# EAGLE design cooler (EAGLE 8.0.0)
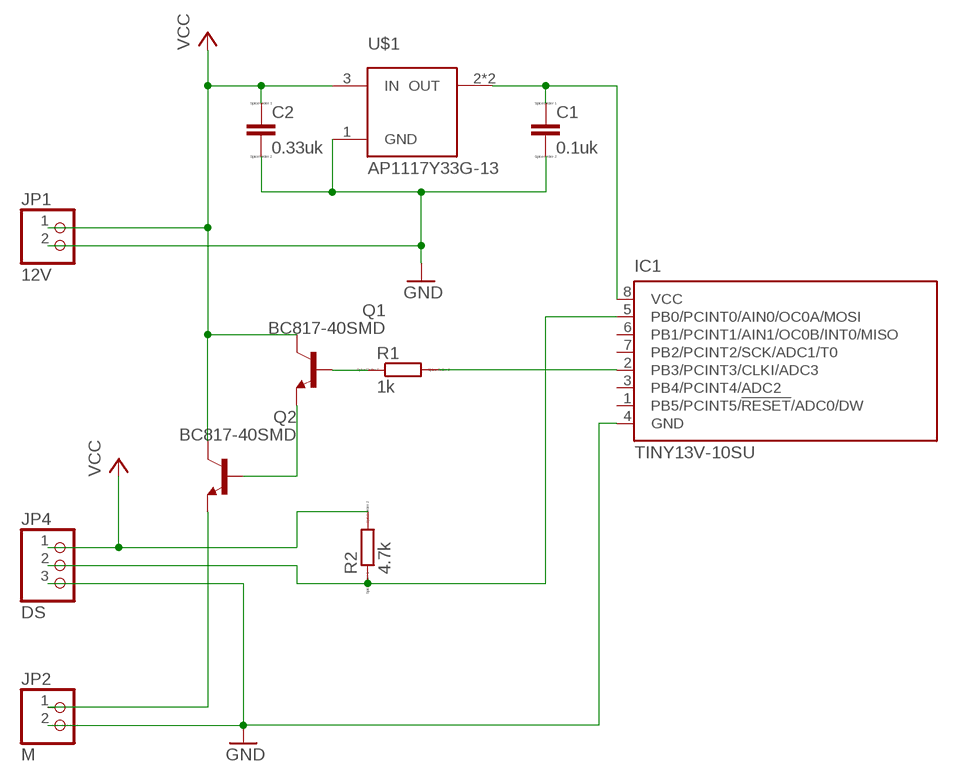
[diagram p0: schematic, sheet 1]

## Parts
C1  0.1uk  C  [C0805]
C2  0.33uk  C  [C0805]
IC1  TINY13V-10SU  [8S2]
JP1  12V  PINHD-1X2/90  [1X02/90]
JP2  M  PINHD-1X2/90  [1X02/90]
JP4  DS  PINHD-1X3/90  [1X03/90]
Q1  BC817-40SMD  [SOT23-BEC]
Q2  BC817-40SMD  [SOT23-BEC]
R1  1k  R  [R0805]
R2  4.7k  R  [R0805]
U$1  AP1117Y33G-13  [SOT89]

## Nets
GND: C1.2 C2.2 IC1.4(GND) JP1.2 JP2.2 JP4.3 U$1.1(GND)
N$1: C1.1 IC1.8(VCC) U$1.2(OUT) U$1.2@1(OUT)
N$2: JP2.1 Q2.E
N$3: Q1.E Q2.B
N$4: Q1.B R1.1
N$5: IC1.2(PB3/PCINT3/CLKI/ADC3) R1.2
N$7: IC1.5(PB0/PCINT0/AIN0/OC0A/MOSI) JP4.2 R2.1
VCC: C2.1 JP1.1 JP4.1 Q1.C Q2.C R2.2 U$1.3(IN)
Unconnected: IC1.1(PB5/PCINT5/!RESET!/ADC0/DW) IC1.3(PB4/PCINT4/ADC2) IC1.6(PB1/PCINT1/AIN1/OC0B/INT0/MISO) IC1.7(PB2/PCINT2/SCK/ADC1/T0)

## Library data of the parts
C1 C2 = eagle-ltspice:C: CAPACITOR, European symbol; SPICEMODEL: NONE; SPICEPREFIX: C
IC1 = atmel:TINY13: 8-bit AVR Microcontroller with 1K Bytes In-System Programmable Flash Source: http://www.atmel.com/dyn/resources/prod_documents/2535S.pdf; MPN: ATTINY13V-10SU; OC_FARNELL: 9171584; OC_NEWARK: 96K6524
JP1 JP2 = pinhead:PINHD-1X2: PIN HEADER
JP4 = pinhead:PINHD-1X3: PIN HEADER
Q1 Q2 = transistor-npn:BC817*: NPN Transistor
R1 R2 = eagle-ltspice:R: RESISTOR, European symbol; SPICEMODEL: NONE; SPICEPREFIX: R
U$1 = AP1117Y33G-13:AP1117Y33G-13

## Board
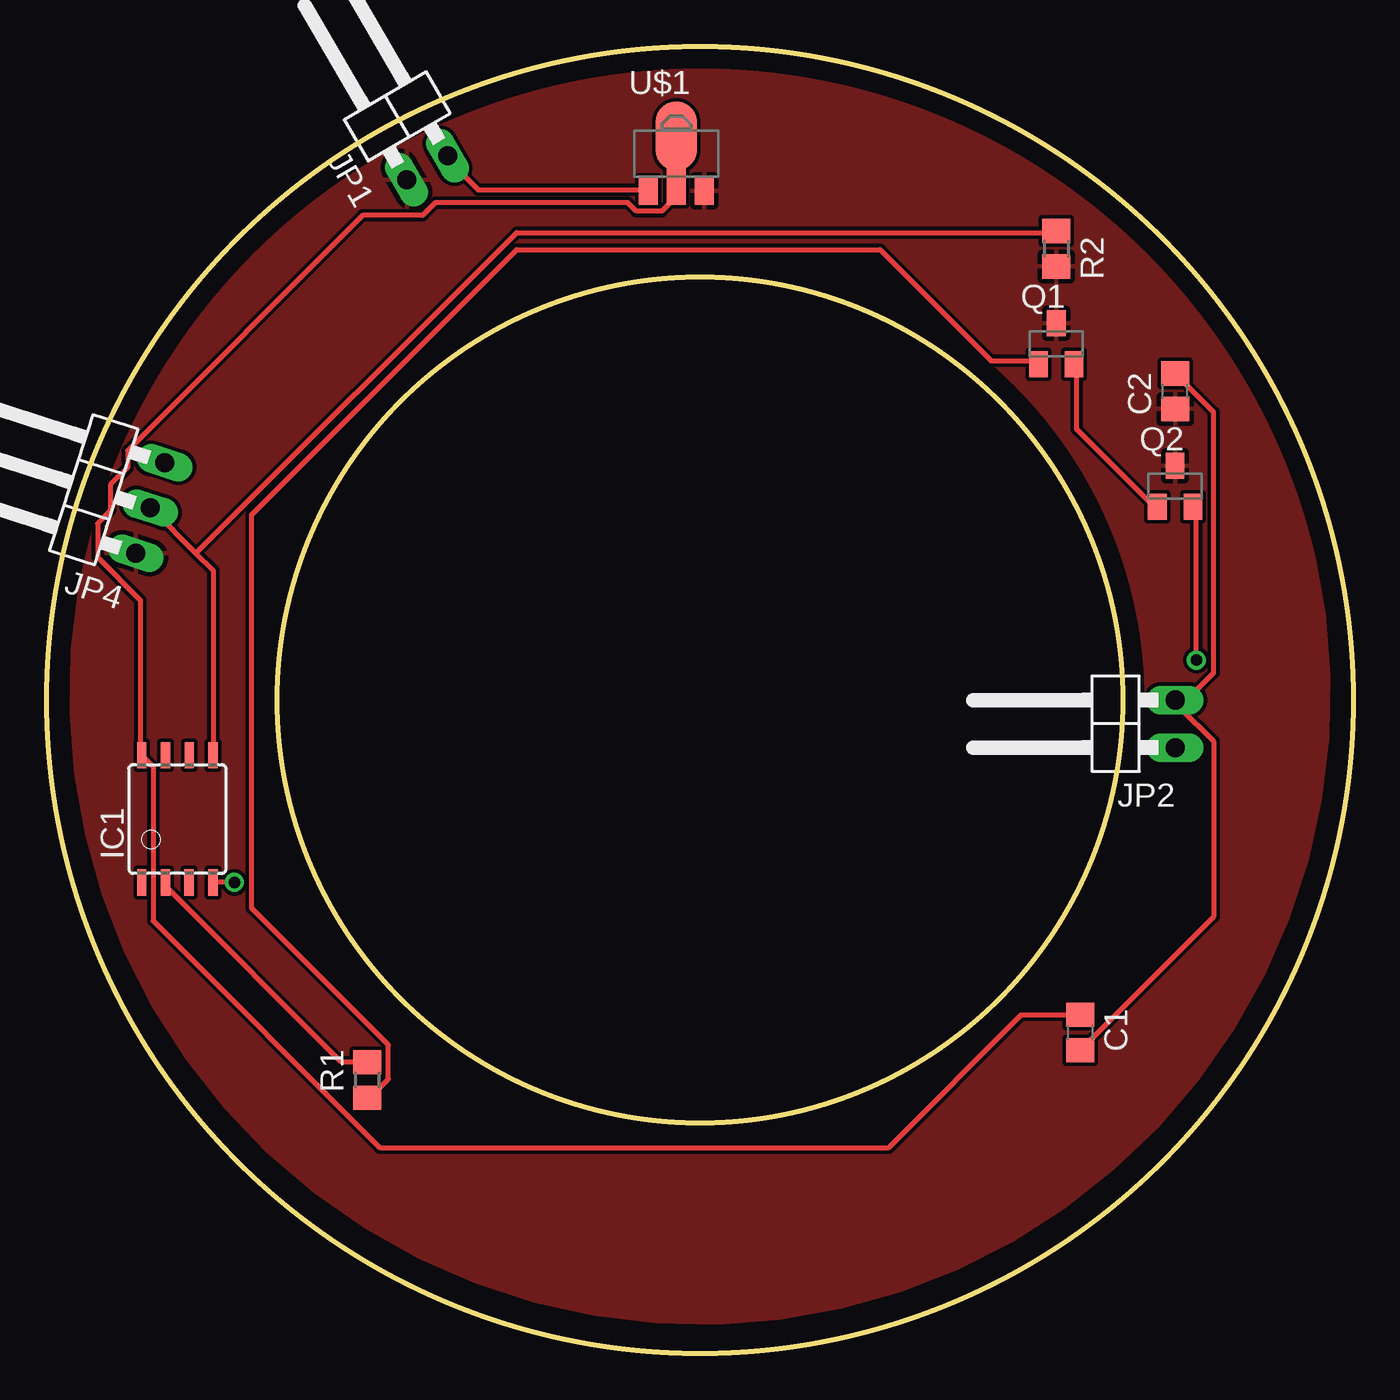
[diagram p1: board, top side]
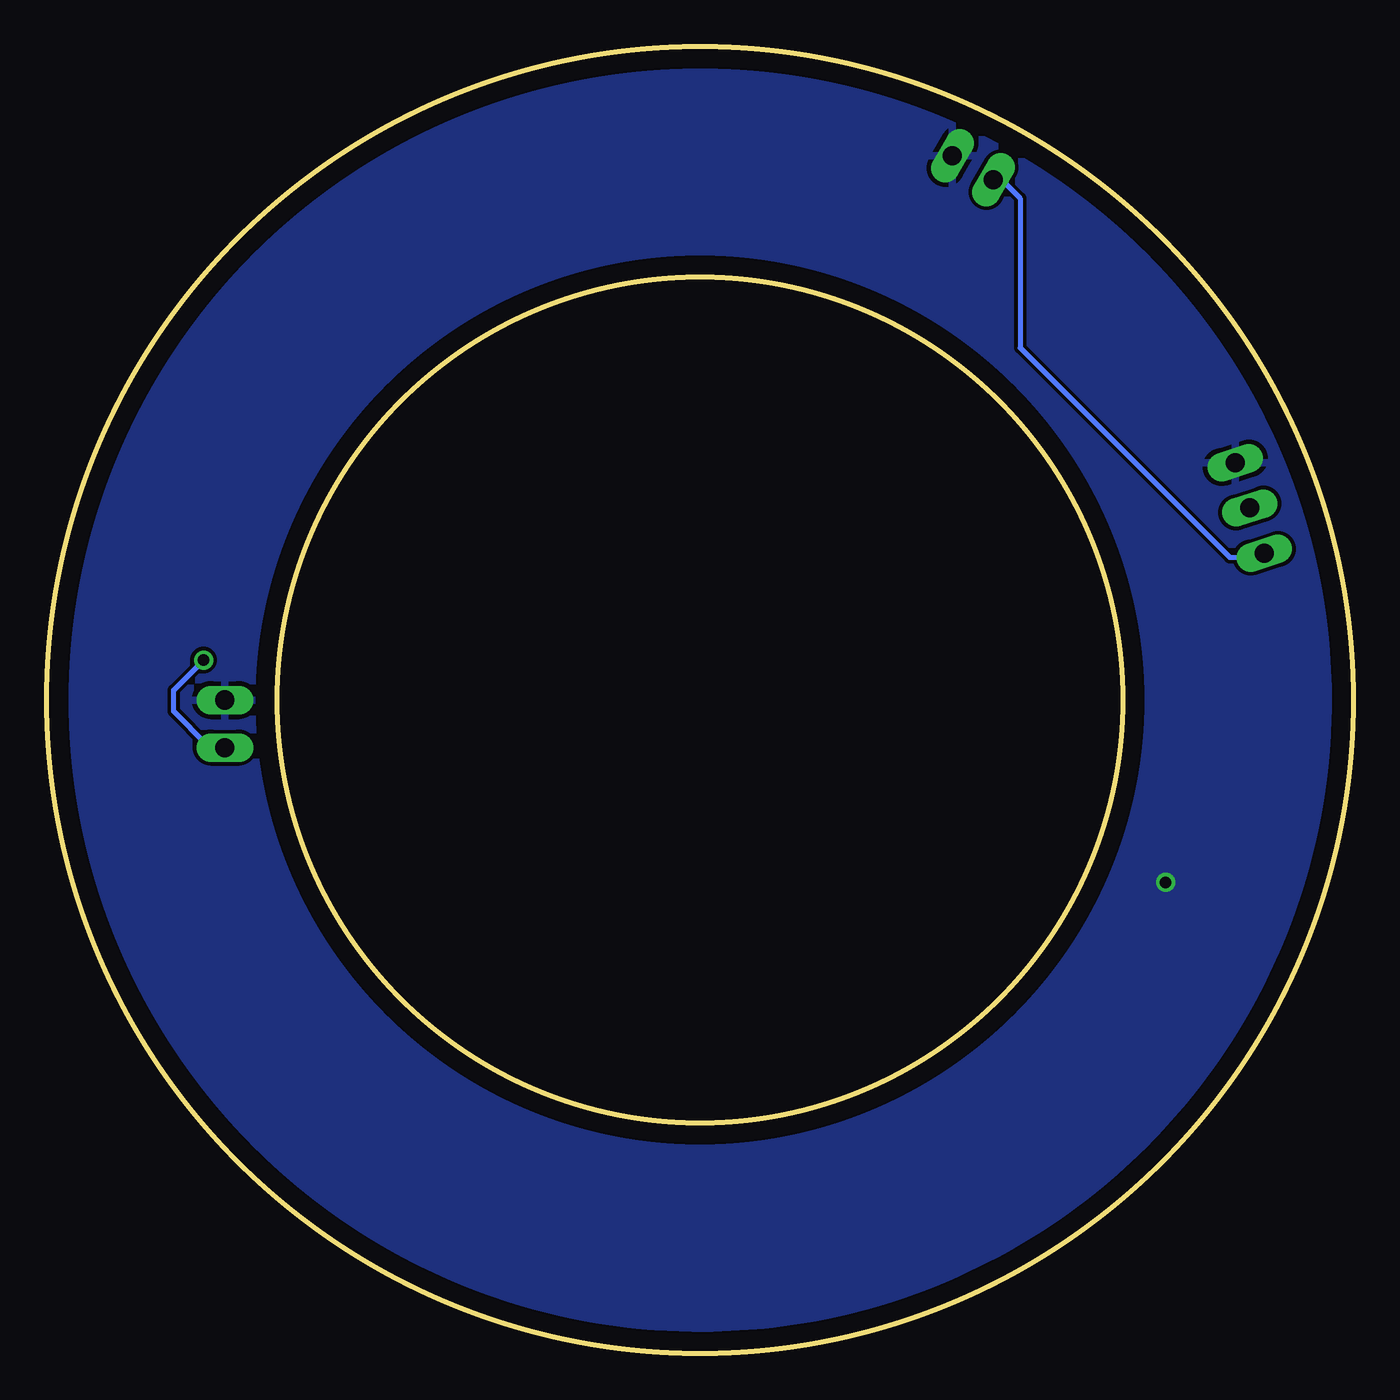
[diagram p2: board, bottom side, seen from below]

Size 69.85 x 69.85 mm. Coordinates in mm from the lower left corner, seen from the top.
Outline: circle at 34.92,34.92 radius 34.92
Outline: circle at 34.92,34.92 radius 22.61
Copper layers (1*16): Top 0.035mm / dielectric 1.5mm / Bottom 0.035mm
Design rules "default": minimum track width 10mil, minimum drill 24mil, track to track 8mil, track to pad 8mil, pad to pad 8mil, via to via 8mil, smd to smd 8mil, copper to edge 40mil, drill to drill 8mil, minimum pad ring 10mil, minimum via ring 8mil, stop-mask expansion 4mil, vias tented up to drill 0mil, thermal gap 10mil

### Footprints (pad centres in the part's own frame; a part is rotated, then mirrored left to right if it is on the bottom)
C0805 = smd 1.3 x 1.5: 1 -0.95,0; 2 0.95,0
8S2 = smd 0.5 x 1.4: 1 -1.905,-3.404; 2 -0.645,-3.404; 3 0.625,-3.404; 4 1.895,-3.404; 5 1.905,3.404; 6 0.635,3.404; 7 -0.635,3.404; 8 -1.905,3.404
1X02/90 = drill 1.016 long: 1 -1.27,-3.81; 2 1.27,-3.81
1X03/90 = drill 1.016 long: 1 -2.54,-3.81; 2 0,-3.81; 3 2.54,-3.81
SOT23-BEC = smd 1 x 1.4: B -0.95,-1.1; C 0,1.1; E 0.95,-1.1
R0805 = smd 1.3 x 1.5: 1 -0.95,0; 2 0.95,0
SOT89 = smd 1 x 1.5: 1 -1.499,-1.981; 3 1.499,-1.981 | smd 1 x 2: 2 0,-1.727 | smd 2.2 x 3.7: 2@1 0,0.94

### Placement (x,y rotation side)
C1  55.24,17.14 270 top
C2  60.32,51.43 90 top
IC1  6.98,28.57 0 top
JP1  18.41,66.67 30.2 top
JP2  56.51,33.65 90 top
JP4  1.9,46.35 72.2 top
Q1  53.97,53.97 0 top
Q2  60.32,46.35 0 top
R1  17.14,14.6 90 top
R2  53.97,59.05 270 top
U$1  33.65,64.13 0 top

### Tracks (layer width: path | path; a pad name or v marks a point on that pad's centre or on a via)
GND  (via drill 0.61)
  Top 0.254: v10.03,25.17 IC1.4 | 60.55,34.54 60.32,34.77 JP2.2 60.55,34.54 | 60.55,34.54 62.38,32.71 62.38,23.34 55.3,16.26 C1.2 | U$1.1 31.98,62.2 23.06,62.2 21.46,63.8 JP1.2 | 60.55,34.54 62.38,36.37 62.38,50.32 C2.2
  pour Bottom: 1.9,28.57 arc-180 67.94,41.27 arc-180
N$1
  Top 0.254: C1.1 55.07,18.08 52.09,18.08 45.01,11 17.8,11 5.69,23.11 5.69,31.34 5.23,31.8 IC1.8 5,32.03 5,40.26 2.72,42.54 2.72,44.37 3.4,45.06 3.4,46.43 4.32,47.35 4.32,48.26 16.89,60.83 20.09,60.83 20.78,61.52 31.06,61.52 31.52,61.06 32.89,61.06 33.58,61.75 33.58,62.2 U$1.2 33.81,62.43 33.81,64.95 U$1.2@1
N$2  (via drill 0.61)
  Top 0.254: v61.47,37.06 61.47,45.06 Q2.E
  Bottom 0.254: v61.47,37.06 63.07,35.46 63.07,34.31 61.24,32.49 60.32,32.49 JP2.1
N$3
  Top 0.254: Q1.E 55.07,52.83 55.07,49.4 59.18,45.29 Q2.B
N$4
  Top 0.254: Q1.B 53.01,53.06 50.49,53.06 44.55,59 25.12,59 10.95,44.83 10.95,23.8 18.26,16.48 18.26,14.66 17.35,13.74 R1.1
N$5
  Top 0.254: IC1.2 6.37,24.94 15.75,15.57 17.12,15.57 R1.2
N$7
  Top 0.254: IC1.5 8.89,41.86 7.98,42.77 | 7.98,42.77 5.69,45.06 JP4.2 | 7.98,42.77 25.12,59.92 53.92,59.92 R2.1
VCC
  Bottom 0.254: JP4.1 4.77,42.54 6.6,42.54 17.8,53.75 17.8,61.75 18.72,62.66 19.18,62.66 JP1.1
  pour Top: 8.25,55.88 arc-180 61.59,14.6 arc-180